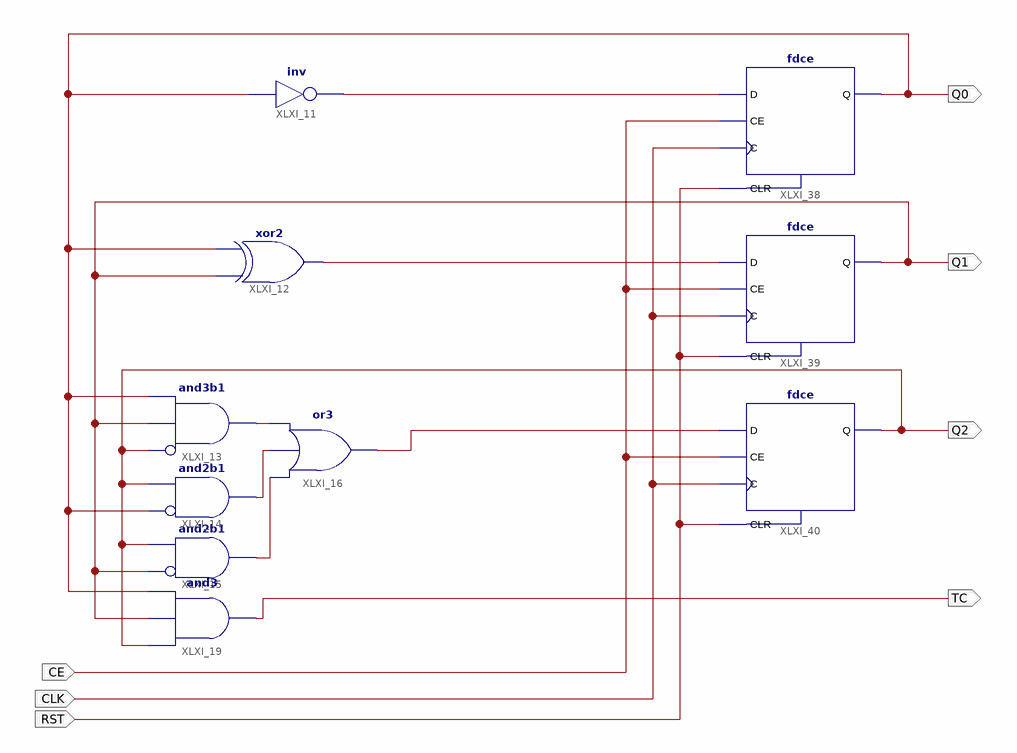
[diagram p0: schematic sheet 1]
// Xilinx ISE schematic licznik3bit.sch (spartan3e) as structural Verilog: 10 symbols, 7 ports
module licznik3bit (
  input  RST,
  input  CLK,
  input  CE,
  output Q0,
  output Q1,
  output Q2,
  output TC
);

  wire XLXN_7, XLXN_9, XLXN_10, XLXN_87, XLXN_88, XLXN_89;

  not XLXI_11 (XLXN_89, Q0);
  xor XLXI_12 (XLXN_88, Q1, Q0);
  and XLXI_13 (XLXN_10, ~Q2, Q1, Q0);  // and3b1
  and XLXI_14 (XLXN_9, ~Q0, Q2);  // and2b1
  and XLXI_15 (XLXN_7, ~Q1, Q2);  // and2b1
  or XLXI_16 (XLXN_87, XLXN_7, XLXN_9, XLXN_10);
  and XLXI_19 (TC, Q2, Q1, Q0);
  fdce XLXI_38 (.C(CLK), .CE(CE), .CLR(RST), .D(XLXN_89), .Q(Q0));
  fdce XLXI_39 (.C(CLK), .CE(CE), .CLR(RST), .D(XLXN_88), .Q(Q1));
  fdce XLXI_40 (.C(CLK), .CE(CE), .CLR(RST), .D(XLXN_87), .Q(Q2));
endmodule
